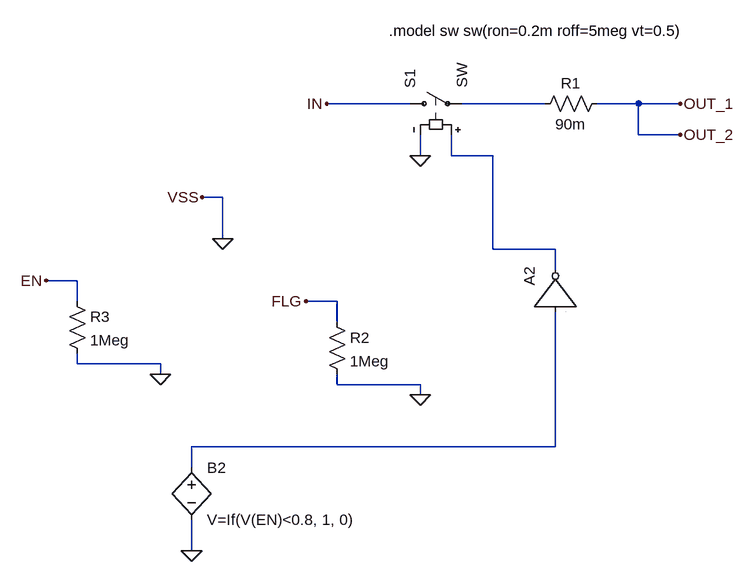
[diagram p0: schematic AP2151D.asc]
AP2151D.asc, the LTspice schematic file:
Version 4
SHEET 1 1112 692
WIRE 320 -32 192 -32
WIRE 528 -32 400 -32
WIRE 672 -32 608 -32
WIRE 736 -32 672 -32
WIRE 672 16 672 -32
WIRE 736 16 672 16
WIRE 336 48 336 16
WIRE 384 48 384 16
WIRE 448 48 384 48
WIRE 32 112 0 112
WIRE 32 176 32 112
WIRE 448 192 448 48
WIRE 544 192 448 192
WIRE 544 224 544 192
WIRE -192 240 -240 240
WIRE -192 272 -192 240
WIRE 208 272 160 272
WIRE 208 304 208 272
WIRE -192 368 -192 352
WIRE -64 368 -192 368
WIRE -64 384 -64 368
WIRE 208 400 208 384
WIRE 336 400 208 400
WIRE 336 416 336 400
WIRE 544 496 544 288
WIRE 544 496 -16 496
WIRE -16 528 -16 496
WIRE -16 656 -16 608
FLAG 0 112 VSS
FLAG 32 176 0
FLAG 336 48 0
FLAG 192 -32 IN
FLAG 736 -32 OUT_1
FLAG 736 16 OUT_2
FLAG -16 656 0
FLAG 160 272 FLG
FLAG 336 416 0
FLAG -240 240 EN
FLAG -64 384 0
SYMBOL sw 304 -32 R270
SYMATTR InstName S1
SYMBOL res 624 -48 R90
WINDOW 0 0 56 VBottom 2
WINDOW 3 32 56 VTop 2
SYMATTR InstName R1
SYMATTR Value 90m
SYMBOL bv -16 512 R0
SYMATTR InstName B2
SYMATTR Value V=If(V(EN)<0.8, 1, 0)
SYMBOL Digital\\inv 480 288 R270
SYMATTR InstName A2
SYMBOL res 192 288 R0
SYMATTR InstName R2
SYMATTR Value 1Meg
SYMBOL res -208 256 R0
SYMATTR InstName R3
SYMATTR Value 1Meg
TEXT 288 -144 Left 2 !.model sw sw(ron=0.2m roff=5meg vt=0.5)

The netlist it stands for:
* AP2151D.asc
S1 IN N001 N002 0 SW
R1 OUT_2 N001 90m
B2 N003 0 V=If(V(EN)<0.8, 1, 0)
A2 N003 0 0 0 0 N002 0 0 BUF
R2 FLG 0 1Meg
R3 EN 0 1Meg
.model sw sw(ron=0.2m roff=5meg vt=0.5)
.backanno
.end